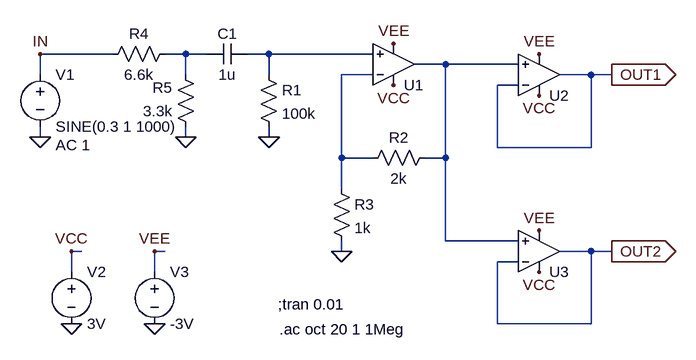
[diagram p0: schematic 2Out_Headphone_Amp.asc]
2Out_Headphone_Amp.asc, the LTspice schematic file:
Version 4
SHEET 1 880 680
WIRE -416 -16 -528 -16
WIRE -304 -16 -336 -16
WIRE -272 -16 -304 -16
WIRE -176 -16 -208 -16
WIRE -16 -16 -176 -16
WIRE 96 0 48 0
WIRE 208 0 96 0
WIRE -528 16 -528 -16
WIRE -304 16 -304 -16
WIRE -176 16 -176 -16
WIRE -16 16 -64 16
WIRE 320 16 272 16
WIRE 352 16 320 16
WIRE 208 32 176 32
WIRE -528 112 -528 96
WIRE -304 112 -304 96
WIRE -176 112 -176 96
WIRE 176 128 176 32
WIRE 320 128 320 16
WIRE 320 128 176 128
WIRE -64 144 -64 16
WIRE -16 144 -64 144
WIRE 96 144 96 0
WIRE 96 144 64 144
WIRE -64 192 -64 144
WIRE 96 272 96 144
WIRE 208 272 96 272
WIRE -464 288 -480 288
WIRE -336 288 -352 288
WIRE -64 288 -64 272
WIRE 320 288 272 288
WIRE 352 288 320 288
WIRE 208 304 176 304
WIRE -480 320 -480 288
WIRE -352 320 -352 288
WIRE 176 400 176 304
WIRE 320 400 320 288
WIRE 320 400 176 400
FLAG -528 112 0
FLAG -176 112 0
FLAG -64 288 0
FLAG 16 32 VCC
FLAG 16 -32 VEE
FLAG -304 112 0
FLAG 240 -16 VEE
FLAG 240 48 VCC
FLAG 240 256 VEE
FLAG 240 320 VCC
FLAG 352 16 OUT1
IOPIN 352 16 Out
FLAG 352 288 OUT2
IOPIN 352 288 Out
FLAG -480 400 0
FLAG -352 400 0
FLAG -480 288 VCC
FLAG -352 288 VEE
FLAG -528 -16 IN
SYMBOL Opamps\\UniversalOpamp2 16 0 M180
SYMATTR InstName U1
SYMBOL voltage -528 0 R0
WINDOW 123 24 124 Left 2
WINDOW 39 0 0 Left 2
SYMATTR InstName V1
SYMATTR Value SINE(0.3 1 1000)
SYMATTR Value2 AC 1
SYMBOL cap -208 -32 R90
WINDOW 0 0 32 VBottom 2
WINDOW 3 32 32 VTop 2
SYMATTR InstName C1
SYMATTR Value 1u
SYMBOL res -192 0 R0
SYMATTR InstName R1
SYMATTR Value 100k
SYMBOL res 80 128 R90
WINDOW 0 0 56 VBottom 2
WINDOW 3 32 56 VTop 2
SYMATTR InstName R2
SYMATTR Value 2k
SYMBOL res -80 176 R0
SYMATTR InstName R3
SYMATTR Value 1k
SYMBOL res -320 -32 R90
WINDOW 0 0 56 VBottom 2
WINDOW 3 32 56 VTop 2
SYMATTR InstName R4
SYMATTR Value 6.6k
SYMBOL res -288 112 R180
WINDOW 0 36 76 Left 2
WINDOW 3 36 40 Left 2
SYMATTR InstName R5
SYMATTR Value 3.3k
SYMBOL Opamps\\UniversalOpamp2 240 16 M180
SYMATTR InstName U2
SYMBOL Opamps\\UniversalOpamp2 240 288 M180
SYMATTR InstName U3
SYMBOL voltage -480 304 R0
WINDOW 123 0 0 Left 2
WINDOW 39 0 0 Left 2
SYMATTR InstName V2
SYMATTR Value 3V
SYMBOL voltage -352 304 R0
WINDOW 123 0 0 Left 2
WINDOW 39 0 0 Left 2
SYMATTR InstName V3
SYMATTR Value -3V
TEXT -162 370 Left 2 !;tran 0.01
TEXT -160 408 Left 2 !.ac oct 20 1 1Meg

The netlist it stands for:
* 2Out_Headphone_Amp.asc
XU1 N002 N004 VCC VEE N003 level.2 Avol=1Meg GBW=10Meg Slew=10Meg ilimit=25m rail=0 Vos=0 phimargin=45 en=0 enk=0 in=0 ink=0 Rin=500Meg  ; pins IN+ IN- V+ V- OUT
V1 IN 0 SINE(0.3 1 1000) AC 1
C1 N002 N001 1u
R1 N002 0 100k
R2 N003 N004 2k
R3 N004 0 1k
R4 N001 IN 6.6k
R5 0 N001 3.3k
XU2 N003 OUT1 VCC VEE OUT1 level.2 Avol=1Meg GBW=10Meg Slew=10Meg ilimit=25m rail=0 Vos=0 phimargin=45 en=0 enk=0 in=0 ink=0 Rin=500Meg  ; pins IN+ IN- V+ V- OUT
XU3 N003 OUT2 VCC VEE OUT2 level.2 Avol=1Meg GBW=10Meg Slew=10Meg ilimit=25m rail=0 Vos=0 phimargin=45 en=0 enk=0 in=0 ink=0 Rin=500Meg  ; pins IN+ IN- V+ V- OUT
V2 VCC 0 3V
V3 VEE 0 -3V
;tran 0.01
.ac oct 20 1 1Meg
.lib UniversalOpamps2.sub
.backanno
.end